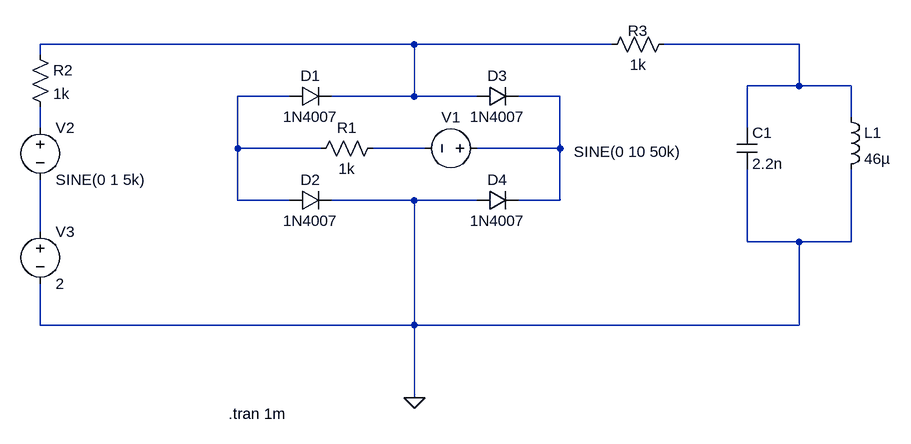
[diagram p0: schematic RingModulator.asc]
RingModulator.asc, the LTspice schematic file:
Version 4
SHEET 1 1028 680
WIRE 288 32 -288 32
WIRE 592 32 288 32
WIRE 880 32 672 32
WIRE -288 48 -288 32
WIRE 880 96 880 32
WIRE 880 96 800 96
WIRE 960 96 880 96
WIRE 96 112 16 112
WIRE 288 112 288 32
WIRE 288 112 160 112
WIRE 384 112 288 112
WIRE 512 112 448 112
WIRE 960 144 960 96
WIRE -288 160 -288 128
WIRE 800 160 800 96
WIRE 16 192 16 112
WIRE 144 192 16 192
WIRE 304 192 224 192
WIRE 512 192 512 112
WIRE 512 192 384 192
WIRE 16 272 16 192
WIRE 96 272 16 272
WIRE 288 272 160 272
WIRE 384 272 288 272
WIRE 512 272 512 192
WIRE 512 272 448 272
WIRE -288 320 -288 240
WIRE 800 336 800 224
WIRE 880 336 800 336
WIRE 960 336 960 224
WIRE 960 336 880 336
WIRE -288 464 -288 400
WIRE 288 464 288 272
WIRE 288 464 -288 464
WIRE 880 464 880 336
WIRE 880 464 288 464
WIRE 288 576 288 464
FLAG 288 576 0
SYMBOL diode 96 128 R270
WINDOW 0 32 32 VTop 2
WINDOW 3 0 32 VBottom 2
SYMATTR InstName D1
SYMATTR Value 1N4007
SYMBOL diode 96 288 R270
WINDOW 0 32 32 VTop 2
WINDOW 3 0 32 VBottom 2
SYMATTR InstName D2
SYMATTR Value 1N4007
SYMBOL diode 384 128 R270
WINDOW 0 32 32 VTop 2
WINDOW 3 0 32 VBottom 2
SYMATTR InstName D3
SYMATTR Value 1N4007
SYMBOL diode 384 288 R270
WINDOW 0 32 32 VTop 2
WINDOW 3 0 32 VBottom 2
SYMATTR InstName D4
SYMATTR Value 1N4007
SYMBOL voltage 400 192 R90
WINDOW 0 -32 56 VBottom 2
WINDOW 3 -10 -216 VTop 2
WINDOW 123 0 0 Left 0
WINDOW 39 0 0 Left 0
SYMATTR InstName V1
SYMATTR Value SINE(0 10 50k)
SYMBOL res 240 176 R90
WINDOW 0 0 56 VBottom 2
WINDOW 3 32 56 VTop 2
SYMATTR InstName R1
SYMATTR Value 1k
SYMBOL voltage -288 144 R0
WINDOW 123 0 0 Left 0
WINDOW 39 0 0 Left 0
SYMATTR InstName V2
SYMATTR Value SINE(0 1 5k)
SYMBOL voltage -288 304 R0
WINDOW 123 0 0 Left 0
WINDOW 39 0 0 Left 0
SYMATTR InstName V3
SYMATTR Value 2
SYMBOL res -304 32 R0
SYMATTR InstName R2
SYMATTR Value 1k
SYMBOL cap 784 160 R0
SYMATTR InstName C1
SYMATTR Value 2.2n
SYMBOL ind 944 128 R0
SYMATTR InstName L1
SYMATTR Value 46µ
SYMBOL res 688 16 R90
WINDOW 0 11 56 VBottom 2
WINDOW 3 32 56 VTop 2
SYMATTR InstName R3
SYMATTR Value 1k
TEXT 2 600 Left 2 !.tran 1m

The netlist it stands for:
* RingModulator.asc
D1 N003 N001 1N4007
D2 N003 0 1N4007
D3 N001 N004 1N4007
D4 0 N004 1N4007
V1 N004 N006 SINE(0 10 50k)
R1 N006 N003 1k
V2 N005 N007 SINE(0 1 5k)
V3 N007 0 2
R2 N001 N005 1k
C1 N002 0 2.2n
L1 N002 0 46µ
R3 N002 N001 1k
.model D D
.lib standard.dio
.tran 1m
.backanno
.end